# Altium schematic sheet Sheet1.SchDoc
size A; SheetNumber: 1; SheetTotal: 1
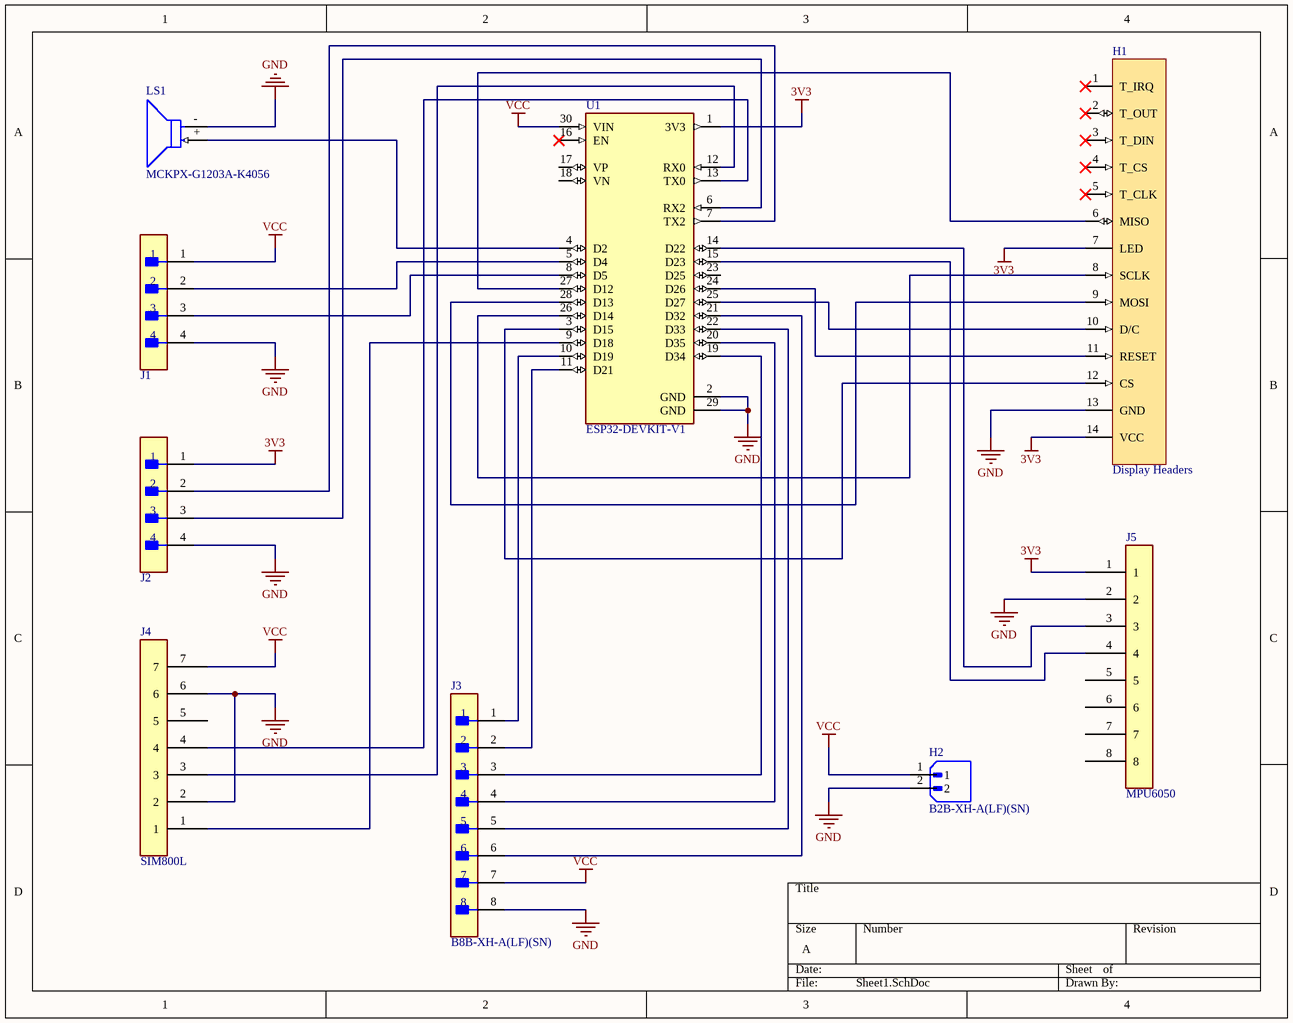
[diagram p0: Sheet1.SchDoc]

## Parts
H1  Display Headers  [SULLINS_PPTC061LFBN-RC]
H2  B2B-XH-A(LF)(SN)  [JST_B2B-XH-A(LF)(SN)]
J1  B04B-XASK-1(LF)(SN)  [FP-B04B-XASK-1_LF_SN-MFG]  (value not drawn)
J2  GPS  [GPS]  (value not drawn)
J3  B8B-XH-A(LF)(SN)  [FP-B8B-XH-A_LF_SN-MFG]
J4  SIM800L  [SIM800L]
J5  MPU6050  [MPU6050]
LS1  MCKPX-G1203A-K4056  [FP-MCKPX-G1203A-K4056-MFG - duplicate]
U1  ESP32-DEVKIT-V1  [MODULE_ESP32_DEVKIT_V1]

## Nets
3V3: H1.7(LED) H1.14(VCC) J2.1 J5.1 U1.1(3V3)
GND: H1.13(GND) H2.2 J1.4 J2.4 J3.8 J4.2 J4.6 J5.2 LS1.- U1.2(GND) U1.29(GND)
VCC: H2.1 J1.1 J3.7 J4.7 U1.30(VIN)
NetH1_6: H1.6(MISO) U1.27(D12)
NetH1_8: H1.8(SCLK) U1.26(D14)
NetH1_9: H1.9(MOSI) U1.28(D13)
NetH1_10: H1.10(D/C) U1.25(D27)
NetH1_11: H1.11(RESET) U1.24(D26)
NetH1_12: H1.12(CS) U1.3(D15)
NetJ1_2: J1.2 U1.5(D4)
NetJ1_3: J1.3 U1.8(D5)
NetJ2_2: J2.2 U1.7(TX2)
NetJ2_3: J2.3 U1.6(RX2)
NetJ3_1: J3.1 U1.10(D19)
NetJ3_2: J3.2 U1.11(D21)
NetJ3_3: J3.3 U1.19(D34)
NetJ3_4: J3.4 U1.20(D35)
NetJ3_5: J3.5 U1.22(D33)
NetJ3_6: J3.6 U1.21(D32)
NetJ4_1: J4.1 U1.9(D18)
NetJ4_3: J4.3 U1.12(RX0)
NetJ4_4: J4.4 U1.13(TX0)
NetJ5_3: J5.3 U1.14(D22)
NetJ5_4: J5.4 U1.15(D23)
NetLS1_+: LS1.+ U1.4(D2)

Not connected (* = marked no-connect by the designer): H1 1(T_IRQ)* 2(T_OUT)* 3(T_DIN)* 4(T_CS)* 5(T_CLK)*; J4 5; J5 5 6 7 8; U1 16(EN)* 17(VP) 18(VN) 23(D25)

## Library data of the parts
H1 = TFT-LCD-2.8'' Display Headers
H2 = B2B-XH-A(LF)(SN): Connector Header Through Hole 2 position 0.098 (2.50mm); MF: JST Sales America Inc.; SnapEDA_Link: https://www.snapeda.com/parts/B2B-XH-A(LF)(SN)/JST+Sales+America+Inc./view-part/?ref=snap; Package: None; Value: *; MP: B2B-XH-A(LF)(SN); Check_prices: https://www.snapeda.com/parts/B2B-XH-A(LF)(SN)/JST+Sales+America+Inc./view-part/?ref=eda
J1 = CMP-17439-000018-1: CONN HEADER VERT 4POS 2.5MM; Manufacturer: JST; Current Rating: 3A; Voltage Rating: 250V; Conn Orientation: Straight; Conn Gender: Male; Number Of Contacts: 4; ComponentLink2Description: Datasheet; Package: B04B-XASK-1(LF)(SN); Octopart: https://octopart.com/b04b-xask-1%28lf%29%28sn%29-jst-3990149; Pitch: 2.5mm; Device Class L1: Connectors; RoHS: TRUE; Device Class L3: unset; Manufacturer Part Number: B04B-XASK-1(LF)(SN); Temperature Range High: +85°C; Height: 8.8mm; Lead Free: Yes; Category: Conn; Temperature: -25°C to +85°C; Digikey Description: CONN HEADER VERT 4POS 2.5MM; Temperature Range Low: -25°C; ComponentLink2URL: http://www.jst-mfg.com/product/pdf/eng/eXA1.pdf; Contact Material: Tin,Copper; Device Class L2: Headers and Wire Housings; Automotive: No; Number Of Rows: 1
J2 = GPS: Manufacturer Part Number: B04B-XASK-1(LF)(SN); Manufacturer: JST; Current Rating: 3A; Pitch: 2.5mm; Voltage Rating: 250V; Conn Orientation: Straight; Conn Gender: Male; Number Of Contacts: 4; ComponentLink2Description: Datasheet; Package: B04B-XASK-1(LF)(SN); Octopart: https://octopart.com/b04b-xask-1%28lf%29%28sn%29-jst-3990149; Device Class L1: Connectors; RoHS: TRUE; Device Class L3: unset; Temperature Range High: +85°C; Height: 8.8mm; Lead Free: Yes; Category: Conn; Temperature: -25°C to +85°C; Digikey Description: CONN HEADER VERT 4POS 2.5MM; Temperature Range Low: -25°C; ComponentLink2URL: http://www.jst-mfg.com/product/pdf/eng/eXA1.pdf; Contact Material: Tin,Copper; Device Class L2: Headers and Wire Housings; Automotive: No; Number Of Rows: 1
J3 = CMP-17438-000015-1: CONN HEADER VERT 8POS 2.5MM; Voltage Rating (AC): 250V; Insulation Resistance: 1GR; Connector Type: Male Pin; Max Current Rating: 3A; Wire/Cable Gauge: 22AWG; Number of Contacts: 8; Contact Resistance: 20mR; Orientation: Straight; Pitch: 2.5mm; Min Operating Temperature: -25°C; Number of Rows: 1; Contact Type: Male Pin; Packaging: Bulk; Lead Free: Lead Free; Max Operating Temperature: 85°C; Housing Material: Polyamide; Voltage Rating: 250V; Series: XH; Mount: Through Hole; Depth: 5.75mm; Contact Material: Brass; Fastening Type: Detent; Color: Natural; Max Voltage Rating (AC): 250V; Number of Positions: 8; Housing Color: White; Contact Plating: Tin; Lead Pitch: 2.5mm; Length: 22.4mm; REACH SVHC: No SVHC; Termination: Press-Fit; Current Rating: 3A
LS1 = MCKPX-G1203A-K4056: MAGNETIC BUZZER AND TRANSDUCER - More Details; Manufacturer: Multicomp Pro; Operating Supply Voltage: 3V; Current: 30mA; Frequency: 2300Hz; Max Supply Voltage: 5V; Min Supply Voltage: 2V; Standoff Height: 0.5mm; ComponentLink2Description: Datasheet; ComponentLink2URL: http://www.farnell.com/datasheets/1498149.pdf?_ga=2.17855225.1157923166.1572356775-536200964.1569240579; Manufacturer Part Number: MCKPX-G1203A-K4056; Temperature Range High: +70°C; Device Class L2: Audio Products; Temperature Range Low: -20°C; Package: 0; Temperature: -20°C to +70°C; Category: Speak; Octopart: https://octopart.com/mckpx-g1203a-k4056-multicomp-12157154; RoHS: TRUE; Lead Free: Yes; Height: 9.5mm; Device Class L1: Electromechanical; Automotive: No; Device Class L3: Buzzers
U1 = ESP32-DEVKIT-V1: Dual core, Wi-Fi: 2.4 GHz up to 150 Mbits/s,BLE (Bluetooth Low Energy) and legacy Bluetooth, 32 bits, Up to 240 MHz; MF: Do it; SnapEDA_Link: https://www.snapeda.com/parts/ESP32-DEVKIT-V1/Do+it/view-part/?ref=snap; Package: None; Value: *; MP: ESP32-DEVKIT-V1; Check_prices: https://www.snapeda.com/parts/ESP32-DEVKIT-V1/Do+it/view-part/?ref=eda